# EAGLE design Receiver (11-15) (EAGLE 8.4.0)
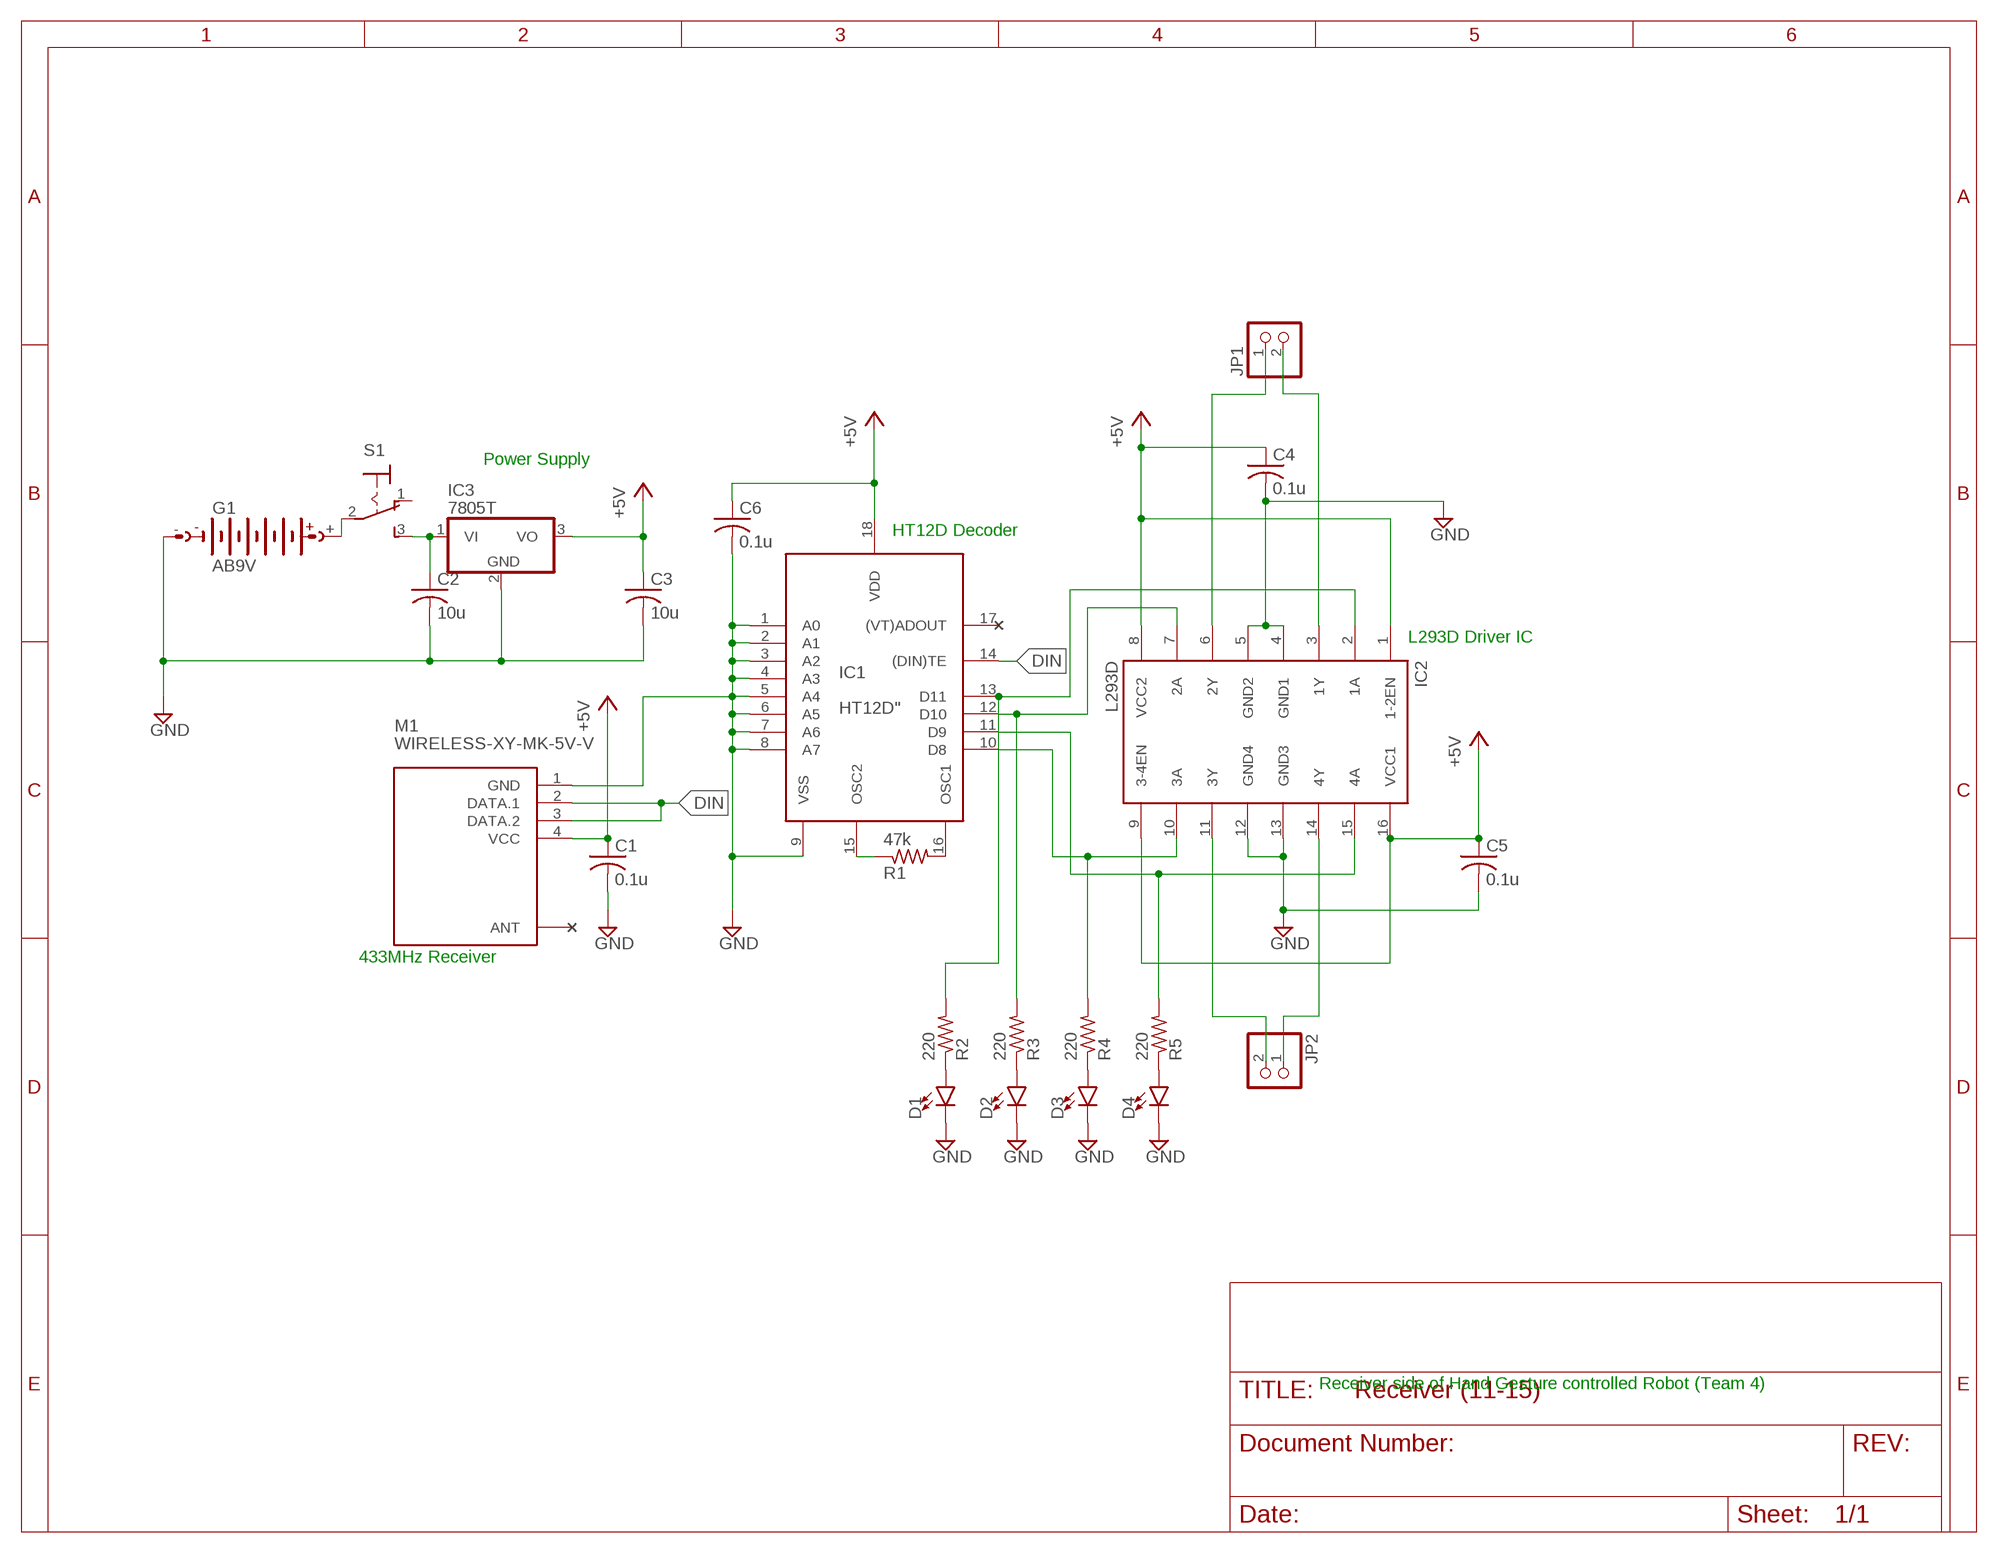
[diagram p0: schematic, sheet 1]

## Parts
C1  0.1u  C-USC0805  [C0805]
C2  10u  C-USC0805  [C0805]
C3  10u  C-USC0805  [C0805]
C4  0.1u  C-USC0805  [C0805]
C5  0.1u  C-USC0805  [C0805]
C6  0.1u  C-USC0805  [C0805]
D1  LED3MM  [LED_3MM]
D2  LED3MM  [LED_3MM]
D3  LED3MM  [LED_3MM]
D4  LED3MM  [LED_3MM]
G1  AB9V  [AB9V]
IC1  HT12D"  [18-DIP-A]
IC2  L293D  [DIL16]
IC3  7805T  [TO220H]
JP1  PINHD-1X2  [1X02]
JP2  PINHD-1X2  [1X02]
M1  WIRELESS-XY-MK-5V-V  [WIRELESS-XY-MK-5V#V]
R1  47k  R-US_R0805  [R0805]
R2  220  R-US_R0805  [R0805]
R3  220  R-US_R0805  [R0805]
R4  220  R-US_R0805  [R0805]
R5  220  R-US_R0805  [R0805]
S1  M9040P  [M9040P]

## Nets
+5V: C1.1 C3.1 C4.1 C5.1 C6.1 IC1.18(VDD) IC2.1(1-2EN) IC2.8(VCC2) IC2.9(3-4EN) IC2.16(VCC1) IC3.3(VO) M1.4(VCC)
DIN: IC1.14((DIN)TE) M1.2(DATA.1) M1.3(DATA.2)
GND: C1.2 C2.2 C3.2 C4.2 C5.2 C6.2 D1.K(C) D2.K(C) D3.K(C) D4.K(C) G1.- IC1.1(A0) IC1.2(A1) IC1.3(A2) IC1.4(A3) IC1.5(A4) IC1.6(A5) IC1.7(A6) IC1.8(A7) IC1.9(VSS) IC2.4(GND1) IC2.5(GND2) IC2.12(GND4) IC2.13(GND3) IC3.2(GND) M1.1(GND)
N$1: IC1.16(OSC1) R1.2
N$2: IC2.6(2Y) JP1.1
N$3: IC1.10(D8) IC2.10(3A) R4.2
N$4: IC1.15(OSC2) R1.1
N$5: D1.A R2.1
N$6: IC1.11(D9) IC2.15(4A) R5.2
N$7: IC1.12(D10) IC2.7(2A) R3.2
N$8: IC1.13(D11) IC2.2(1A) R2.2
N$9: IC2.3(1Y) JP1.2
N$10: G1.+ S1.2(P)
N$11: IC2.11(3Y) JP2.2
N$12: IC2.14(4Y) JP2.1
N$13: D2.A R3.1
N$14: D3.A R4.1
N$16: D4.A R5.1
N$17: C2.1 IC3.1(VI) S1.3(S)
Unconnected: IC1.17((VT)ADOUT) M1.ANT S1.1(O)

## Notes on the sheet
- Power Supply
- HT12D Decoder
- L293D Driver IC
- 433MHz Receiver
- Receiver side of Hand Gesture controlled Robot (Team 4)

## Library data of the parts
C1-C6 = adafruit:C-US: CAPACITOR, American symbol
D1-D4 = SparkFun-LED:LED: LED (Generic) Standard schematic elements and footprints for 5mm, 3mm, 1206, and 0603 sized LEDs. Generic LEDs with no color specified.; PROD_ID: DIO-08794
G1 = battery:AB9V: 9-V BATTERY CLIP
IC1 = holtek:HT12D: decoder = receiver ic
IC2 = st-microelectronics:L293D: PUSH-PULL 4 CHANNEL DRIVER; MPN: L293D; OC_FARNELL: 9589619; OC_NEWARK: 56P8249
IC3 = adafruit:78*: Positive VOLTAGE REGULATOR Added bigger pads to the TO-92 package
JP1 JP2 = pinhead:PINHD-1X2: PIN HEADER
M1 = diy-modules:WIRELESS-XY-MK-5V: RF Wireless XY-MK-5V Receiver Click here to find device on ebay.com <http://www.ebay.com/sch/xd+rf+5v-receiver> Note: Sold together with transmitter.
R1-R5 = adafruit:R-US_: RESISTOR, American symbol
S1 = switch:M9040P: TOGGLE SWITCH Marquardt

## Net classes
0 default: width 0.178 mm, drill 0.406 mm, clearance 0.203 mm
2 VCC: width 1.27 mm, drill 0.406 mm, clearance 0.203 mm to class 0, clearance 0.203 mm to class 1, clearance 0.203 mm

## Board
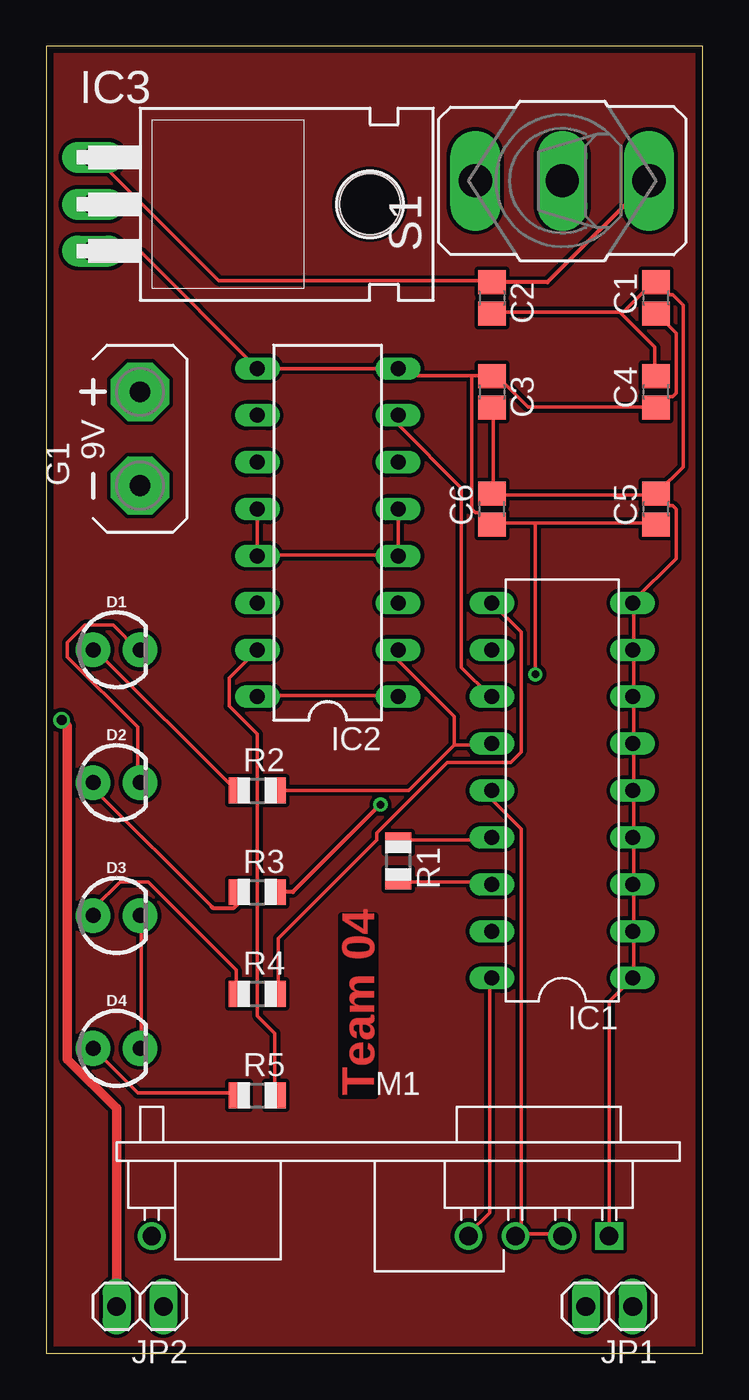
[diagram p1: board, top side]
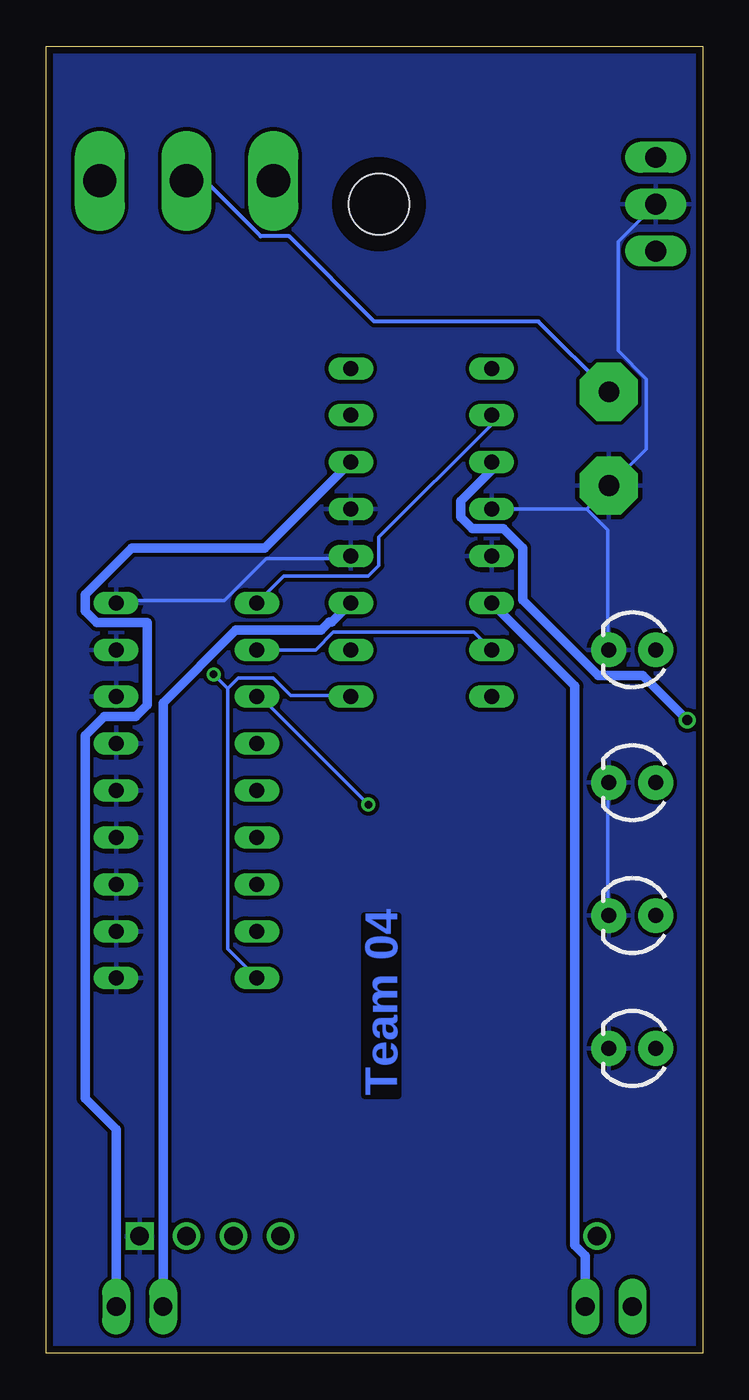
[diagram p2: board, bottom side, seen from below]

Size 35.54 x 70.79 mm. Coordinates in mm from the lower left corner, seen from the top.
Outline: 0,0 35.54,0 35.54,70.79 0,70.79 0,0
Copper layers (1*16): Top 0.0356mm / dielectric 1.5011mm / Bottom 0.0356mm
Design rules "LaenPCBOrder": minimum track width 6mil, minimum drill 13mil, track to track 6mil, track to pad 6mil, pad to pad 6mil, via to via 6mil, smd to smd 6mil, copper to edge 15mil, drill to drill 6mil, minimum pad ring 7mil, minimum via ring 7mil, stop-mask expansion 3mil, vias tented up to drill 0mil, thermal gap 10mil

### Footprints (pad centres in the part's own frame; a part is rotated, then mirrored left to right if it is on the bottom)
C0805 = smd 1.3 x 1.5: 1 -0.85,0; 2 0.85,0
LED_3MM = drill 0.813 pad 1.88: A -1.27,0; K 1.27,0
AB9V = drill 1.118 pad 3.15 octagon: + 0,2.54; - 0,-2.54
18-DIP-A = drill 0.813 long: 1 -10.16,-3.81; 2 -7.62,-3.81; 3 -5.08,-3.81; 4 -2.54,-3.81; 5 0,-3.81; 6 2.54,-3.81; 7 5.08,-3.81; 8 7.62,-3.81; 9 10.16,-3.81; 10 10.16,3.81; 11 7.62,3.81; 12 5.08,3.81; 13 2.54,3.81; 14 0,3.81; 15 -2.54,3.81; 16 -5.08,3.81; 17 -7.62,3.81; 18 -10.16,3.81
DIL16 = drill 0.813 long: 1 -8.89,-3.81; 2 -6.35,-3.81; 3 -3.81,-3.81; 4 -1.27,-3.81; 5 1.27,-3.81; 6 3.81,-3.81; 7 6.35,-3.81; 8 8.89,-3.81; 9 8.89,3.81; 10 6.35,3.81; 11 3.81,3.81; 12 1.27,3.81; 13 -1.27,3.81; 14 -3.81,3.81; 15 -6.35,3.81; 16 -8.89,3.81
TO220H = drill 1.118 long: 1 -2.54,-10.16; 2 0,-10.16; 3 2.54,-10.16 | hole 3.302: 0,4.826
1X02 = drill 1.016 long: 1 -1.27,0; 2 1.27,0
WIRELESS-XY-MK-5V#V = drill 1 square: 1 11.43,0 | drill 1: 2 8.89,0; 3 6.35,0; 4 3.81,0; ANT -13.335,0
R0805 = smd 1.1 x 1.4: 1 -1,0; 2 1,0
M9040P = drill 1.803 long: 1 0,4.699; 2 0,0; 3 0,-4.699

### Placement (x,y rotation side)
C1  33.02,57.15 90 top
C2  24.13,57.15 270 top
C3  24.13,52.07 270 top
C4  33.02,52.07 90 top
C5  33.02,45.72 90 top
C6  24.13,45.72 90 top
D1  3.81,38.1 0 top
D2  3.81,30.9 0 top
D3  3.81,23.71 0 top
D4  3.81,16.51 0 top
G1  5.08,49.53 0 top
IC1  27.94,30.48 90 top
IC2  15.24,44.45 90 top
IC3  12.7,62.23 270 top
JP1  30.48,2.54 180 top
JP2  5.08,2.54 180 top
M1  19.05,6.35 0 top
R1  19.05,26.67 270 top
R2  11.43,30.48 0 top
R3  11.43,24.98 0 top
R4  11.43,19.47 0 top
R5  11.43,13.97 0 top
S1  27.94,63.5 90 top

### Tracks (layer width: path | path; a pad name or v marks a point on that pad's centre or on a via)
+5V  (via drill 0.41)
  Top 0.178: IC2.16 11.43,35.62 19.05,35.62 IC2.1 | IC1.18 24,20.19 24,7.62 22.86,6.48 M1.4 | 26.48,44.96 32.96,44.96 C5.1 | 26.48,44.96 24.19,44.96 C6.1 24,44.96 23.43,45.53 23.24,45.53 23.05,45.72 23.05,52.96 | C1.1 33.15,56.2 34.1,55.24 34.1,52.01 33.91,51.82 33.72,51.82 33.15,51.24 C4.1 32.96,51.24 26.1,51.24 24.57,52.77 24.19,52.77 C3.1 24,52.96 23.05,52.96 | 23.05,52.96 19.43,52.96 IC2.8 IC2.9 5.14,59.63 2.67,59.63 IC3.3 | 26.48,44.96 v26.48,36.77
  Bottom 0.178: 25.72,36.01 25.15,36.58 23.24,36.58 22.29,35.62 19.05,35.62 IC2.1 | 25.72,36.01 25.72,21.91 IC1.18 | v26.48,36.77 25.72,36.01
DIN
  Top 0.178: 25.53,6.48 25.72,6.67 25.72,28.38 24.19,29.91 24.19,30.48 IC1.14 | 25.53,6.48 27.81,6.48 M1.2 | 25.53,6.48 M1.3
GND
  Top 0.178: 31.81,22.86 31.81,20.38 IC1.1 30.48,19.05 M1.1 | 31.81,22.86 31.81,25.34 IC1.3 31.81,25.53 31.81,27.81 IC1.4 31.81,28 31.81,30.48 | 31.81,22.86 IC1.2 | 31.05,56.39 31.24,56.39 32.96,58.1 C1.2 33.15,57.91 33.72,57.34 33.91,57.34 34.48,56.77 34.48,48.01 33.15,46.67 C5.2 | 31.05,56.39 24.19,56.39 C2.2 | 31.05,56.39 32.96,54.48 32.96,52.96 C4.2 | 31.81,30.48 31.81,32.96 IC1.6 31.81,33.15 31.81,35.43 IC1.7 31.81,35.62 31.81,38.1 | C3.2 24.19,51.05 24.19,46.67 C6.2 24.19,46.48 32.96,46.48 C5.2 | C5.2 33.15,46.48 33.72,45.91 33.91,45.91 34.1,45.72 34.1,43.05 31.81,40.77 IC1.9 31.81,40.58 31.81,38.1 | 31.81,38.1 IC1.8 | 31.81,30.48 IC1.5 | D4.K 5.14,16.57 5.14,24 D3.K | IC2.5 19.05,43.24 | IC2.12 11.43,43.24 | 11.43,43.24 19.05,43.24 | 19.05,43.24 IC2.4 | 11.43,43.24 IC2.13 | D2.K 4.95,30.48 4.95,33.91 1.14,37.72 1.14,38.48 2.1,39.43 3.62,39.43 4.95,38.1 D1.K
  Bottom 0.178: D2.K 5.14,30.48 5.14,24.19 D3.K | 6.29,45.72 IC2.12 | 6.29,45.72 5.14,46.86 G1.- 4.95,47.05 3.05,48.96 3.05,52.77 4.57,54.29 4.57,60.2 IC3.2 | 6.29,45.72 5.14,44.58 5.14,38.1 D1.K | IC1.9 31.62,40.77 25.91,40.77 23.62,43.05 19.05,43.05 IC2.4
  pour Bottom: 0,71.12 35.56,71.12 35.56,0 0,0
N$1
  Top 0.178: R1.2 19.05,25.53 24,25.53 IC1.16
N$2
  Bottom 0.508: IC2.6 23.71,43.6 30.91,43.6 33.43,41.08 33.43,40.2 32.8,39.57 30.07,39.57 30.07,35.12 30.7,34.49 32.4,34.49 33.43,33.46 33.43,13.81 31.75,12.14 JP1.1
N$3
  Top 0.178: IC1.10 25.72,39.05 25.72,32.58 25.15,32 21.72,32 17.91,28.19 17.91,27.81 12.57,22.48 12.57,19.05 R4.2
  Bottom 0.178: IC2.10 11.43,50.29 17.53,44.2 17.53,42.67 18.1,42.1 22.67,42.1 IC1.10
N$4
  Top 0.178: R1.1 19.05,27.81 24,27.81 IC1.15
N$5
  Top 0.178: R2.1 10.29,30.48 2.67,38.1 D1.A
N$6
  Top 0.178: IC2.15 9.91,36.58 9.91,35.05 11.43,33.53 11.43,18.29 12.38,17.34 12.38,14.1 R5.2
  Bottom 0.178: IC1.11 20.95,38.1 20,39.05 12.38,39.05 IC2.15
N$7  (via drill 0.41)
  Top 0.178: IC2.7 19.05,50.29 22.48,46.86 22.48,37.15 24,35.62 IC1.12
  Top 0.203: v18.1,29.72 13.36,24.98 R3.2
  Bottom 0.178: v18.1,29.72 24,35.62 IC1.12
N$8
  Top 0.178: R2.2 19.62,30.48 22.1,32.96 | 22.1,32.96 24,32.96 IC1.13 | IC2.2 19.05,37.53 22.1,34.48 22.1,32.96
N$9
  Bottom 0.508: JP1.2 29.21,35.22 25.27,39.17 20.66,39.17 20.23,39.6 20.09,39.6 IC2.3
N$10
  Bottom 0.203: G1.+ 8.89,55.88 17.78,55.88 22.39,60.49 23.93,60.49 26.94,63.5 S1.2
N$11  (via drill 0.55)
  Top 0.508: JP2.2 3.81,13.26 1.14,15.93 1.14,33.98 v0.83,34.29
  Bottom 0.508: v0.83,34.29 3.25,36.7 5.66,36.7 9.75,40.8 9.75,43.62 10.79,44.65 12.48,44.65 13.11,45.28 13.11,46.16 11.43,47.84 IC2.11
N$12
  Bottom 0.508: JP2.1 6.35,5.28 6.92,5.85 6.92,36.13 IC2.14
N$13
  Top 0.178: 8.95,24.19 2.67,30.48 D2.A
  Top 0.203: 8.95,24.19 9.02,24.13 10.16,24.13 10.43,24.4 R3.1
N$14
  Top 0.178: R4.1 10.29,19.05 10.29,20.77 5.52,25.53 4,25.53 2.67,24.19 D3.A
N$15
  pour Top: 0,71.12 35.56,71.12 35.56,0 0,0
N$16
  Top 0.178: D4.A 4.95,14.1 10.29,14.1 R5.1
N$17
  Top 0.178: C2.1 24,58.1 9.34,58.1 2.67,64.77 IC3.1
  Top 0.203: S1.3 27.14,58 C2.1

### Text on the board
Top: Team 04
Bottom: Team 04